# EAGLE design SIHMTEST (EAGLE 8.0.0)
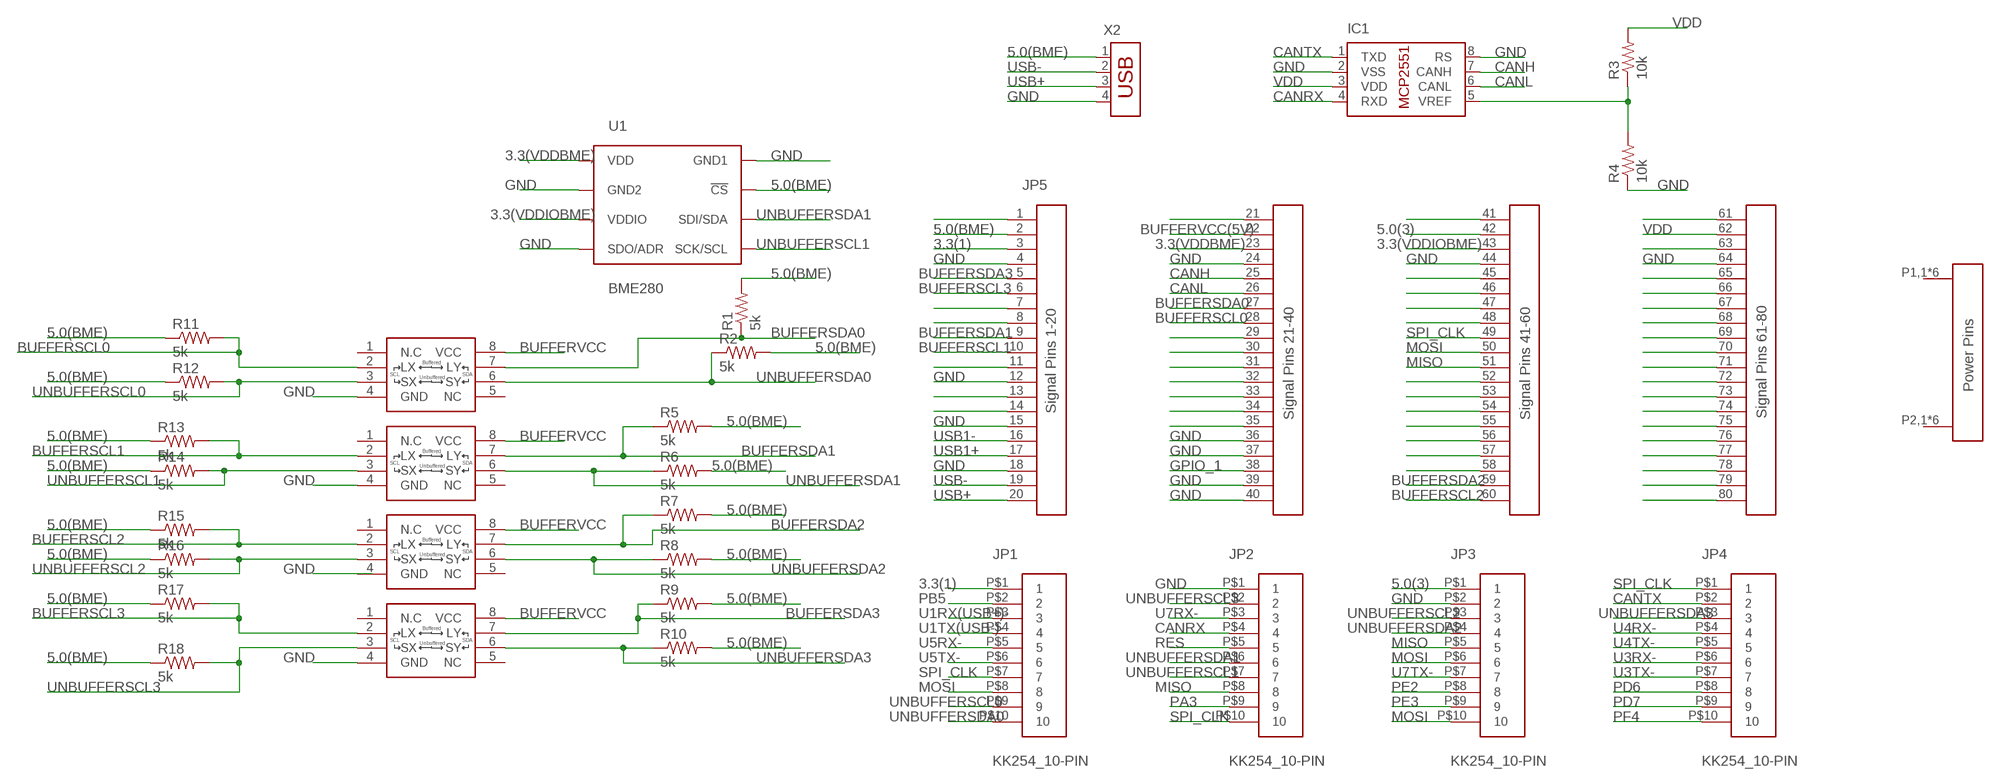
[diagram p0: schematic, sheet 1]

## Parts
IC1  MCP2551/SN  [SO08]
JP1  KK254_10-PIN  [KK254_10-PIN]
JP2  KK254_10-PIN  [KK254_10-PIN]
JP3  KK254_10-PIN  [KK254_10-PIN]
JP4  KK254_10-PIN  [KK254_10-PIN]
JP5  MPSC-01-80MPSC-RA-LC  [MPSC-01-80]
R1  5k  R-US_R0805  [R0805]
R2  5k  R-US_R0805  [R0805]
R3  10k  R-US_R0805  [R0805]
R4  10k  R-US_R0805  [R0805]
R5  5k  R-US_R0805  [R0805]
R6  5k  R-US_R0805  [R0805]
R7  5k  R-US_R0805  [R0805]
R8  5k  R-US_R0805  [R0805]
R9  5k  R-US_R0805  [R0805]
R10  5k  R-US_R0805  [R0805]
R11  5k  R-US_R0805  [R0805]
R12  5k  R-US_R0805  [R0805]
R13  5k  R-US_R0805  [R0805]
R14  5k  R-US_R0805  [R0805]
R15  5k  R-US_R0805  [R0805]
R16  5k  R-US_R0805  [R0805]
R17  5k  R-US_R0805  [R0805]
R18  5k  R-US_R0805  [R0805]
U1  BME280  [BME280_LGA]
U$1  P82B715  [SO8]
U$2  P82B715  [SO8]
U$3  P82B715  [SO8]
U$4  P82B715  [SO8]
X2  USB-787616  [USB]

## Nets
3.3(1): JP1.P$1 JP5.3
3.3(VDDBME): JP5.23 U1.P$8(VDD)
3.3(VDDIOBME): JP5.43 U1.P$6(VDDIO)
5.0(3): JP3.P$1 JP5.42
5.0(BME): JP5.2 R1.2 R2.2 R5.2 R6.2 R7.2 R8.2 R9.2 R10.2 R11.1 R12.1 R13.1 R14.1 R15.1 R16.1 R17.1 R18.1 U1.P$2(!CS) X2.1
BUFFERSCL0: JP5.28 R11.2 U$1.2(LX)
BUFFERSCL1: JP5.10 R13.2 U$2.2(LX)
BUFFERSCL2: JP5.60 R15.2 U$3.2(LX)
BUFFERSCL3: JP5.6 R17.2 U$4.2(LX)
BUFFERSDA0: JP5.27 R1.1 U$1.7(LY)
BUFFERSDA1: JP5.9 R5.1 U$2.7(LY)
BUFFERSDA2: JP5.59 R7.1 U$3.7(LY)
BUFFERSDA3: JP5.5 R9.1 U$4.7(LY)
BUFFERVCC: U$1.8(VCC) U$2.8(VCC) U$3.8(VCC) U$4.8(VCC)
BUFFERVCC(5V): JP5.22
CANH: IC1.7(CANH) JP5.25
CANL: IC1.6(CANL) JP5.26
CANRX: IC1.4(RXD) JP2.P$4
CANTX: IC1.1(TXD) JP4.P$2
GND: IC1.2(VSS) IC1.8(RS) JP2.P$1 JP3.P$2 JP5.4 JP5.12 JP5.15 JP5.18 JP5.24 JP5.36 JP5.37 JP5.39 JP5.40 JP5.44 JP5.64 R4.1 U1.P$1(GND1) U1.P$5(SDO/ADR) U1.P$7(GND2) U$1.4(GND) U$2.4(GND) U$4.4(GND) X2.4
GPIO_1: JP5.38
MISO: JP2.P$8 JP3.P$5 JP5.51
MOSI: JP1.P$8 JP3.P$6 JP3.P$10 JP5.50
N$1: JP5.1
N$2: IC1.5(VREF) R3.1 R4.2
N$7: JP5.7
N$8: JP5.8
N$11: JP5.11
N$13: JP5.13
N$14: JP5.14
N$21: JP5.21
N$29: JP5.29
N$30: JP5.30
N$31: JP5.31
N$32: JP5.32
N$33: JP5.33
N$34: JP5.34
N$35: JP5.35
N$41: JP5.41
N$45: JP5.45
N$46: JP5.46
N$47: JP5.47
N$48: JP5.48
N$52: JP5.52
N$53: JP5.53
N$54: JP5.54
N$55: JP5.55
N$56: JP5.56
N$57: JP5.57
N$58: JP5.58
N$61: JP5.61
N$63: JP5.63
N$65: JP5.65
N$66: JP5.66
N$67: JP5.67
N$68: JP5.68
N$69: JP5.69
N$70: JP5.70
N$71: JP5.71
N$72: JP5.72
N$73: JP5.73
N$74: JP5.74
N$75: JP5.75
N$76: JP5.76
N$77: JP5.77
N$78: JP5.78
N$79: JP5.79
N$80: JP5.80
PA3: JP2.P$9
PB5: JP1.P$2
PD6: JP4.P$8
PD7: JP4.P$9
PE2: JP3.P$8
PE3: JP3.P$9
PF4: JP4.P$10
RES: JP2.P$5
SPI_CLK: JP1.P$7 JP2.P$10 JP4.P$1 JP5.49
U1RX(USB+)-: JP1.P$3
U1TX(USB-)-: JP1.P$4
U3RX-: JP4.P$6
U3TX-: JP4.P$7
U4RX-: JP4.P$4
U4TX-: JP4.P$5
U5RX-: JP1.P$5
U5TX-: JP1.P$6
U7RX-: JP2.P$3
U7TX-: JP3.P$7
UNBUFFERSCL0: JP1.P$9 R12.2 U$1.3(SX)
UNBUFFERSCL1: JP2.P$7 R14.2 U1.P$4(SCK/SCL) U$2.3(SX)
UNBUFFERSCL2: JP3.P$3 R16.2 U$3.3(SX)
UNBUFFERSCL3: JP2.P$2 R18.2 U$4.3(SX)
UNBUFFERSDA0: JP1.P$10 R2.1 U$1.6(SY)
UNBUFFERSDA1: JP2.P$6 R6.1 U1.P$3(SDI/SDA) U$2.6(SY)
UNBUFFERSDA2: JP3.P$4 R8.1 U$3.6(SY)
UNBUFFERSDA3: JP4.P$3 R10.1 U$4.6(SY)
USB1+: JP5.17
USB1-: JP5.16
USB+: JP5.20 X2.3
USB-: JP5.19 X2.2
VDD: IC1.3(VDD) JP5.62 R3.2
Unconnected: JP5.P1,1(POWER1) JP5.P1,2(POWER1) JP5.P1,3(POWER1) JP5.P1,4(POWER1) JP5.P1,5(POWER1) JP5.P1,6(POWER1) JP5.P2,1(POWER2) JP5.P2,2(POWER2) JP5.P2,3(POWER2) JP5.P2,4(POWER2) JP5.P2,5(POWER2) JP5.P2,6(POWER2) U$1.1(N.C) U$1.5(NC) U$2.1(N.C) U$2.5(NC) U$3.1(N.C) U$3.4(GND) U$3.5(NC) U$4.1(N.C) U$4.5(NC)

## Library data of the parts
IC1 = microchip-dspic:MCP2551: High-Speed CAN Transceiver
JP1-JP4 = molex:KK254_10-PIN: KK254 10-pin Datasheet <http://www.molex.com/molex/products/datasheet.jsp?part=active/0022102101_PCB_HEADERS.xml>
JP5 = samtec:MPSC-01-80
R1-R18 = resistor:R-US_: RESISTOR, American symbol
U1 = BME280ComponentLibrary:BME280; PROD_ID: IC-13090
U$1-U$4 = NXP:P82B715
X2 = con-amp:USB-787616: AMP connector

## Board
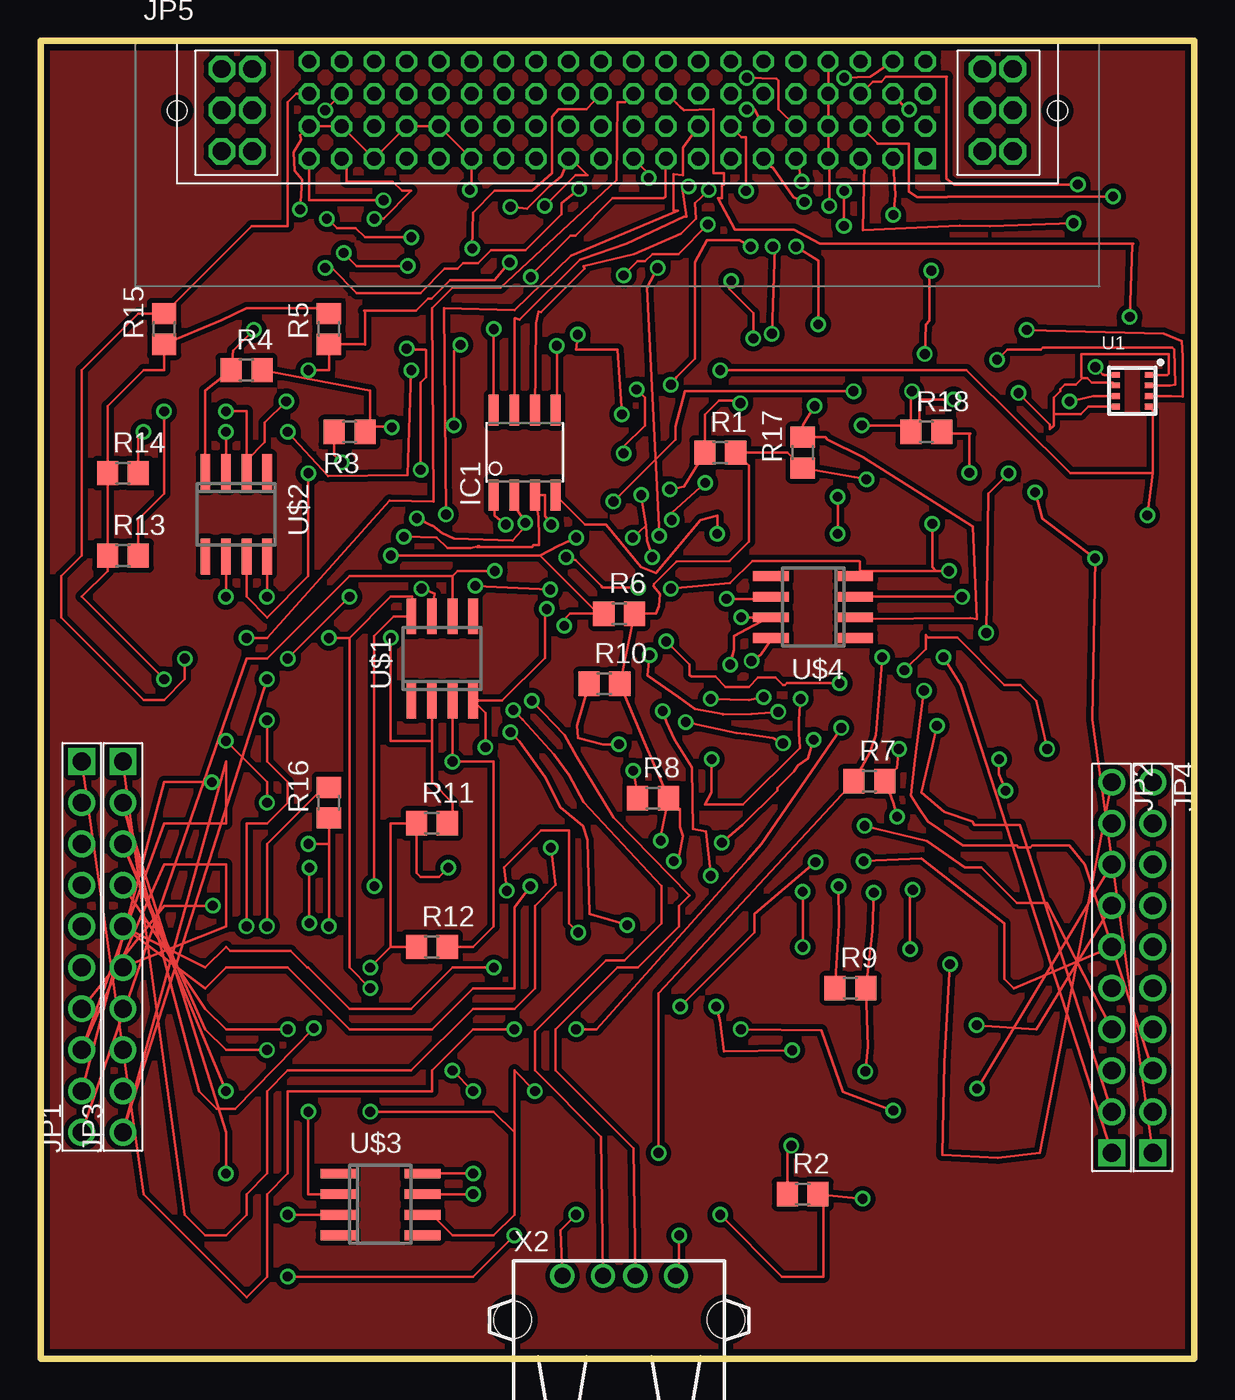
[diagram p1: board, top side]
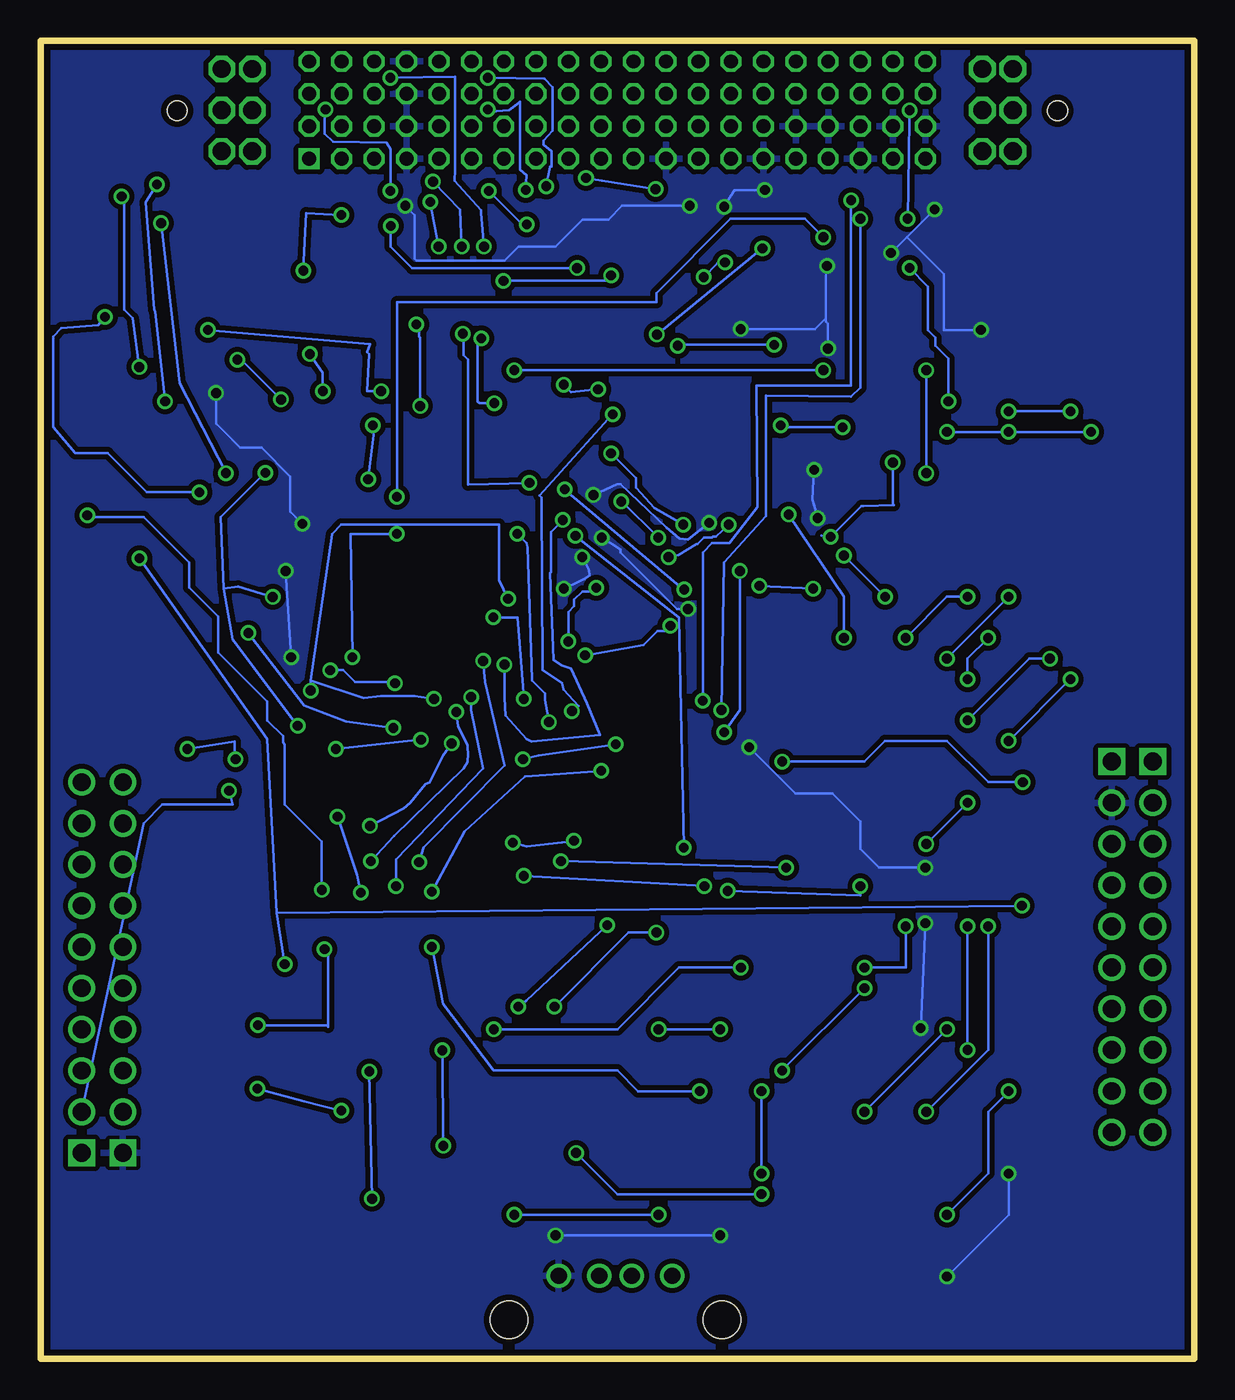
[diagram p2: board, bottom side, seen from below]

Size 71.12 x 81.28 mm. Coordinates in mm from the lower left corner, seen from the top.
Outline: 0,0 0,81.28 71.12,81.28 71.12,0 0,0
Copper layers (1*16): Top 0.0356mm / dielectric 1.5011mm / Bottom 0.0356mm
Design rules "OshPark": minimum track width 6mil, minimum drill 13mil, track to track 6mil, track to pad 6mil, pad to pad 6mil, via to via 6mil, smd to smd 6mil, copper to edge 15mil, drill to drill 6mil, minimum pad ring 7mil, minimum via ring 7mil, stop-mask expansion 3mil, vias tented up to drill 0mil, thermal gap 10mil

### Footprints (pad centres in the part's own frame; a part is rotated, then mirrored left to right if it is on the bottom)
SO08 = smd 0.61 x 1.905: 1 -1.905,-2.616; 2 -0.635,-2.616; 3 0.635,-2.616; 4 1.905,-2.616; 5 1.905,2.616; 6 0.635,2.616; 7 -0.635,2.616; 8 -1.905,2.616
KK254_10-PIN = drill 1.1 square: P$1 11.43,0 | drill 1.1: P$2 8.89,0; P$3 6.35,0; P$4 3.81,0; P$5 1.27,0; P$6 -1.27,0; P$7 -3.81,0; P$8 -6.35,0; P$9 -8.89,0; P$10 -11.43,0
MPSC-01-80 = drill 0.86 square: 1 19,0.33 | drill 0.86 octagon: 2 17,0.33; 3 15,0.33; 4 13,0.33; 5 11,0.33; 6 9,0.33; 7 7,0.33; 8 5,0.33; 9 3,0.33; 10 1,0.33; 11 -1,0.33; 12 -3,0.33; 13 -5,0.33; 14 -7,0.33; 15 -9,0.33; 16 -11,0.33; 17 -13,0.33; 18 -15,0.33; 19 -17,0.33; 20 -19,0.33; 21 19,2.33; 22 17,2.33; 23 15,2.33; 24 13,2.33; 25 11,2.33; 26 9,2.33; 27 7,2.33; 28 5,2.33; 29 3,2.33; 30 1,2.33; 31 -1,2.33; 32 -3,2.33; 33 -5,2.33; 34 -7,2.33; 35 -9,2.33; 36 -11,2.33; 37 -13,2.33; 38 -15,2.33; 39 -17,2.33; 40 -19,2.33; 41 19,4.33; 42 17,4.33; 43 15,4.33; 44 13,4.33; 45 11,4.33; 46 9,4.33; 47 7,4.33; 48 5,4.33; 49 3,4.33; 50 1,4.33; 51 -1,4.33; 52 -3,4.33; 53 -5,4.33; 54 -7,4.33; 55 -9,4.33; 56 -11,4.33; 57 -13,4.33; 58 -15,4.33; 59 -17,4.33; 60 -19,4.33; 61 19,6.33; 62 17,6.33; 63 15,6.33; 64 13,6.33; 65 11,6.33; 66 9,6.33; 67 7,6.33; 68 5,6.33; 69 3,6.33; 70 1,6.33; 71 -1,6.33; 72 -3,6.33; 73 -5,6.33; 74 -7,6.33; 75 -9,6.33; 76 -11,6.33; 77 -13,6.33; 78 -15,6.33; 79 -17,6.33; 80 -19,6.33 | drill 1.1 octagon: P1,1 -24.385,0.79; P1,2 -22.505,0.79; P1,3 -24.385,3.33; P1,4 -22.505,3.33; P1,5 -24.385,5.87; P1,6 -22.505,5.87; P2,1 24.385,0.789; P2,2 22.505,0.789; P2,3 24.385,3.329; P2,4 22.505,3.329; P2,5 24.385,5.869; P2,6 22.505,5.869 | hole 1.2: -27.145,3.3; 27.145,3.3
R0805 = smd 1.3 x 1.5: 1 -0.95,0; 2 0.95,0
BME280_LGA = smd 0.5 x 0.35: P$1 1.025,0.975; P$2 1.025,0.325; P$3 1.025,-0.325; P$4 1.025,-0.975; P$5 -1.025,-0.975; P$6 -1.025,-0.325; P$7 -1.025,0.325; P$8 -1.025,0.975
SO8 = smd 0.6 x 2.2: 1 -1.905,-2.6; 2 -0.635,-2.6; 3 0.635,-2.6; 4 1.905,-2.6; 5 1.905,2.6; 6 0.635,2.6; 7 -0.635,2.6; 8 -1.905,2.6
USB = drill 1: 1 -3.5,12.99; 2 -1,12.99; 3 1,12.99; 4 3.5,12.99 | hole 2.3: -6.57,10.28; 6.57,10.28

### Placement (x,y rotation side)
IC1  29.84,55.88 0 top
JP1  2.54,25.4 90 top
JP2  66.04,24.13 270 top
JP3  5.08,25.4 90 top
JP4  68.58,24.13 270 top
JP5  35.56,73.66 0 top
R1  41.91,55.88 0 top
R2  46.99,10.16 0 top
R3  19.05,57.15 180 top
R4  12.7,60.96 0 top
R5  17.78,63.5 90 top
R6  35.67,45.95 0 top
R7  51.1,35.62 0 top
R8  37.76,34.58 0 top
R9  49.94,22.86 0 top
R10  34.76,41.62 0 top
R11  24.13,33.02 0 top
R12  24.13,25.4 0 top
R13  5.08,49.53 0 top
R14  5.08,54.61 0 top
R15  7.62,63.5 90 top
R16  17.78,34.29 90 top
R17  46.99,55.88 90 top
R18  54.61,57.15 0 top
U1  67.31,59.69 0 top
U$1  24.77,43.18 0 top
U$2  12.06,52.07 180 top
U$3  20.95,9.53 270 top
U$4  47.62,46.35 90 top
X2  35.67,-7.86 0 top

### Tracks (layer width: path | path; a pad name or v marks a point on that pad's centre or on a via)
3.3(1)  (via drill 0.6)
  Top 0.152: JP1.P$1 6.35,10.16 12.7,3.81 13.97,5.08 13.97,10.16 15.24,11.43 15.24,16.51 24.13,16.51 24.13,17.78 26.67,20.32 v29.21,20.32 | v33.02,20.32 34.29,20.32 43.65,30.82 44.45,31.75 v49.37,38.9 | v58.31,44.76 58.42,53.34 v59.69,54.61 | v63.68,70.02 58.53,69.85 56.69,69.86 50.69,69.58 50.8,73.75 JP5.3
  Bottom 0.152: v29.21,20.32 v33.02,20.32 | v49.37,38.9 52.29,39.3 54.86,40.28 v58.31,44.76 | v59.69,54.61 62.54,60.15 v63.68,70.02
3.3(VDDBME)  (via drill 0.6)
  Top 0.152: U1.P$8 65.58,60.66 65.55,60.69 65.49,60.69 v65.04,61.15 | v66.12,71.67 55.95,71.67 55.89,71.61 54.06,71.61 53.55,71.95 53.55,74.92 51.61,74.92 51.61,74.94 JP5.23
  Bottom 0.152: v65.04,61.15 65.44,64.18 65.95,64.69 65.95,71.5 v66.12,71.67
3.3(VDDIOBME)  (via drill 0.6)
  Top 0.152: U1.P$6 64.91,59.37 v63.44,59.04 | v63.95,72.41 56.35,72.41 55.84,72.75 55.84,78.98 55.89,79.04 52.12,79.04 51.84,78.75 51.32,78.75 JP5.43
  Bottom 0.152: v63.44,59.04 64.06,64.58 64.12,64.69 64.64,71.32 v63.95,72.41
5.0(3)  (via drill 0.6)
  Top 0.152: JP3.P$1 8.89,8.89 10.16,7.62 11.43,7.62 12.7,8.89 12.7,10.16 13.97,11.43 13.97,16.51 15.24,17.78 22.86,17.78 26.67,21.59 29.21,21.59 30.48,22.86 30.48,27.94 31.75,29.21 v31.46,31.52 | v38.14,50.74 37.4,66.04 v38.04,67.25 | v49.53,69.85 49.53,71.99 v49.55,72.01 | v53.55,77.04 53.49,76.89 JP5.42
  Bottom 0.152: v31.46,31.52 31.75,45.72 v38.14,50.74 | v38.04,67.25 48.2,67.25 49.53,68.58 v49.53,69.85 | v49.55,72.01 49.55,74.58 49.78,74.98 53.09,75.04 53.61,75.55 53.61,76.81 v53.55,77.04
5.0(BME)  (via drill 0.6)
  Top 0.152: 17.36,64.77 12.7,64.77 11.17,64.04 R15.1 7.62,60.96 6.35,60.96 4.13,58.74 R14.1 R13.1 4.13,48.58 2.54,46.99 v7.62,41.91 | v11.43,38.1 13.97,35.56 v13.97,34.29 | v16.51,31.75 17.78,31.75 R16.1 v17.78,26.67 | X2.1 32.06,7.93 v33.02,8.89 | v41.91,8.89 45.72,5.08 48.26,5.08 48.26,9.84 R2.2 v50.68,9.87 | v20.32,24.13 21.59,25.4 | 21.59,25.4 R12.1 | 21.59,25.4 21.59,33.02 R11.1 23.18,29.97 23.43,29.72 24.57,29.72 v25.15,30.29 | v50.85,17.72 51,19.24 R9.2 51.29,26.38 v51.38,28.75 | R8.2 37.22,38 R10.2 R6.2 37.95,45.95 38.12,46.41 38.18,47.15 37.78,47.66 37.83,47.78 39.2,49.15 42.46,49.21 43.66,50.41 43.66,55.08 R1.2 46.04,55.88 R17.1 50.17,54.36 v50.92,54.23 | R8.2 39.43,33.91 39.43,32.8 39.6,32.23 39.38,30.98 v39.03,30.69 | R8.2 38.25,32.31 v38.23,31.95 | v42.01,31.83 43.26,32.92 45.43,35.03 45.43,35.2 46.46,36.23 46.69,36.58 47.32,37.03 v47.66,38.18 | v52.92,37.6 52.81,36.43 R7.2 52.12,35.55 52.58,34.29 v52.81,33.43 | U1.P$2 69.62,60.02 69.95,60.06 69.89,62.24 69.78,62.35 61.78,62.35 61.66,62.24 59.61,62.24 v58.98,61.61 | v50.63,57.55 53.26,57.55 R18.1 | v56.29,59.15 54.29,59.15 54.18,59.04 54.18,57.67 R18.1 | R18.1 53.66,59.6 v53.72,59.66 | v54.52,61.95 54.58,63.78 54.81,64.01 54.81,66.98 v54.92,67.09 | v52.58,70.52 52.71,71.78 JP5.2
  Top 0.406: 17.78,64.77 R5.2 17.36,64.77
  Bottom 0.152: v7.62,41.91 v11.43,38.1 | v13.97,34.29 v16.51,31.75 | v33.02,8.89 v41.91,8.89 | v17.78,26.67 17.78,24.13 v20.32,24.13 | v50.85,17.72 v50.68,9.87 | v25.15,30.29 v39.03,30.69 | v38.23,31.95 38.98,31.83 41.15,31.6 v42.01,31.83 | v51.38,28.75 51.61,29.83 v52.81,33.43 | v47.66,38.18 v52.92,37.6 | v50.92,54.23 50.52,57.44 v50.63,57.55 | v58.98,61.61 58.75,61.61 v56.29,59.15 | v53.72,59.66 53.72,60.81 v54.52,61.95 | v54.92,67.09 54.75,70.64 v52.58,70.52
5V
  pour Top (isolate 0.305): 0,81.28 0,0 71.12,0 71.12,81.28
BUFFERSCL0  (via drill 0.6)
  Top 0.152: 24.13,38.1 24.13,35.56 25.4,34.29 25.4,33.34 R11.2 | U$1.2 24.13,38.1 | 24.13,38.1 21.59,38.1 v21.59,44.45 | v25,52.06 24.89,64.77 29.21,64.66 32.7,68.03 39.31,70.78 39.03,70.83 39.03,73.04 39.6,72.98 39.6,74.69 JP5.28
  Bottom 0.152: v21.59,44.45 21.59,46.99 v25,52.06
BUFFERSCL1  (via drill 0.6)
  Top 0.152: R13.2 6.03,51.75 7.62,53.34 v7.62,58.42 | v11.43,58.42 12.7,58.42 U$2.2 12.7,55.39 13.83,56.52 13.83,57.72 v15.14,59.04 | v17.55,67.27 17.95,67.27 19.49,65.72 23.43,65.72 24.92,67.21 25.72,67.21 26.06,67.55 26.98,67.55 27.77,68.35 29.89,68.35 32.12,70.58 32.12,71.27 v33.2,72.12 | v37.49,72.81 37.51,73.04 JP5.10
  Bottom 0.152: v7.62,58.42 v11.43,58.42 | v15.14,59.04 15.14,61.66 15.95,62.47 15.95,62.98 16.4,63.44 16.4,66.12 v17.55,67.27 | v33.2,72.12 36.52,72.64 v37.49,72.81
BUFFERSCL2  (via drill 0.6)
  Top 0.152: JP5.60 15.76,77.99 15.24,77.47 15.24,69.85 13.02,69.85 R15.2 6.03,64.45 2.54,60.96 2.54,49.53 1.27,48.26 1.27,45.72 6.35,40.64 7.62,40.64 8.89,41.91 v8.89,43.18 | v13.97,39.37 13.97,36.83 15.24,35.56 15.24,34.29 13.97,33.02 12.7,33.02 v12.7,26.67 | v16.51,15.24 16.51,10.16 U$3.2
  Bottom 0.152: v8.89,43.18 10.16,43.18 v13.97,39.37 | v12.7,26.67 12.7,19.05 v16.51,15.24
BUFFERSCL3  (via drill 0.6)
  Top 0.152: v47.72,58.75 46.99,57.56 R17.2 48.38,56.83 48.52,56.69 50.69,55.61 57.49,51.32 57.72,45.61 57.32,45.66 50.34,45.61 U$4.2 | v47.95,63.78 47.95,67.72 v46.58,68.58 | v47.09,71.32 46.41,71.61 45.15,73.44 45.03,73.52 JP5.6
  Bottom 0.152: v47.72,58.75 47.72,62.98 47.78,63.04 47.78,63.61 v47.95,63.78 | v46.58,68.58 v47.09,71.32
BUFFERSDA0  (via drill 0.6)
  Top 0.152: U$1.7 24.3,47.19 v23.49,47.49 | v26.8,47.66 v31.43,47.43 | v38.8,53.61 39.66,53.78 R1.1 40.96,58.22 41.83,59.09 42.98,59.09 v43.15,58.92 | v43.95,62.92 43.95,64.47 42.46,65.95 42.46,66.35 v42.58,66.47 | v35.95,66.81 36.8,67.67 37.26,67.67 37.72,68.12 39.32,68.12 v41.15,69.95 | v43.49,72.01 43.49,75.32 43.23,75.32 JP5.27
  Bottom 0.152: v23.49,47.49 v26.8,47.66 | v31.43,47.43 31.89,47.78 v38.8,53.61 | v43.15,58.92 44.06,58.92 44.18,59.04 44.18,62.69 v43.95,62.92 | v42.58,66.47 36.29,66.47 v35.95,66.81 | v41.15,69.95 41.43,69.95 v43.49,72.01
BUFFERSDA1  (via drill 0.6)
  Top 0.152: 12.7,49.53 U$2.7 12.7,46.99 13.97,45.72 16.51,48.26 v16.51,54.61 | v16.51,60.96 17.78,60.96 R5.1 19.98,62.55 20,62.52 20,64.58 19.95,64.64 23.15,64.64 23.89,65.38 24.12,65.38 25.26,66.52 28,66.52 v28.92,67.61 | v30.23,66.69 30.46,67.04 32.69,69.27 32.98,69.27 35.26,71.55 38.41,71.55 38.52,71.67 38.52,73.95 JP5.9
  Bottom 0.152: v16.51,54.61 v16.51,60.96 | v28.92,67.61 29.38,67.55 v30.23,66.69
BUFFERSDA2  (via drill 0.6)
  Top 0.152: U$3.7 v26.67,10.16 | v38.1,12.7 38.1,22.54 R7.1 51.12,37.4 51.49,38.46 v51.89,43.26 | v49.15,50.86 v49.15,53.15 | v22.86,69.15 20,69.15 19.43,69.72 18.29,69.72 v17.66,70.29 | v17.55,76.98 JP5.59
  Bottom 0.152: v26.67,10.16 35.56,10.16 v38.1,12.7 | v51.89,43.26 52.01,50.86 v49.15,50.86 | v49.15,53.15 49.15,65.15 33.15,65.15 33.15,65.72 28.57,70.29 24,70.29 v22.86,69.15 | v17.66,70.29 17.55,76.41 v17.55,76.98
BUFFERSDA3  (via drill 0.6)
  Top 0.152: R9.1 49.22,26.79 v49.21,29.15 | v44.58,40.8 43.66,40.63 v41.32,40.69 | v43.2,45.72 44.29,45.72 44.35,45.66 44.81,45.66 | 44.81,45.66 44.97,45.66 U$4.7 44.81,45.66 | 44.81,45.66 42.75,44.58 42.75,43.72 v42.52,42.8 | v38.92,51.72 38.92,52.18 v40.98,54.01 | v45.09,63.21 45.26,68.52 v45.15,68.58 | v46.92,72.58 46.69,73.86 JP5.5
  Bottom 0.152: v49.21,29.15 49.21,30.8 43.83,36.41 44.58,40.01 v44.58,40.8 | v41.32,40.69 41.72,45.72 v43.2,45.72 | v42.52,42.8 42.52,40.75 42.46,39.66 41.15,38.23 40.86,38.06 36.63,38.46 37.43,40.41 38.41,42.58 38.98,42.75 39.49,43.09 39.72,48.46 39.66,48.52 39.66,50.98 v38.92,51.72 | v40.98,54.01 44.75,53.89 44.75,61.61 45.03,61.89 45.03,63.15 v45.09,63.21 | v45.15,68.58 45.26,70.87 v46.92,72.58
BUFFERVCC  (via drill 0.6)
  Top 0.152: U$3.8 v26.67,11.43 | 19.05,44.45 19.05,24.13 v20.32,22.86 | 19.05,44.45 21.59,46.99 22.92,46.99 U$1.8 21.78,45.78 20.57,44.58 v20.57,29.15 | U$2.8 v13.97,46.99 | v17.78,44.45 19.05,44.45 | v25.4,17.78 v26.67,16.51 | v28.75,28.86 28.57,30.29 30.86,32.58 32.58,32.58 32.58,26.86 v33.15,26.29 | v39.43,21.72 44.01,26.29 44.01,27.43 v47.78,30.63 | v43.83,43.03 44.41,43.43 45.03,44.33 U$4.8
  Bottom 0.152: v26.67,11.43 v26.67,16.51 | v13.97,46.99 15.24,46.99 v17.78,44.45 | v20.32,22.86 v25.4,17.78 | v20.57,29.15 20.57,28.57 v28.75,28.86 | v33.15,26.29 34.86,26.29 v39.43,21.72 | v47.78,30.63 47.49,31.55 42.52,36.58 43.72,41.72 v43.83,43.03
CANH  (via drill 0.6)
  Top 0.152: IC1.7 29.21,64.13 29.26,64.18 29.55,64.06 33.26,67.78 33.43,67.84 36.12,68.75 39.66,70.41 39.83,70.41 39.55,72.3 v39.95,72.3 | v43.55,78.98 45.38,78.92 45.49,78.81 45.49,77.06 JP5.25
  Bottom 0.152: v39.95,72.3 39.72,73.5 39.6,73.5 39.6,74.47 40.12,74.87 40.12,75.09 39.55,75.72 39.55,78.41 40.06,78.92 v43.55,78.98
CANL  (via drill 0.6)
  Top 0.152: IC1.6 30.54,63.86 30.69,64.58 30.86,64.52 33.55,67.21 33.49,67.38 36.58,68.12 39.49,69.38 40.41,70.29 40.35,71.27 v41.2,72.07 | v43.55,77.04 44.03,77.04 JP5.26
  Bottom 0.152: v41.2,72.07 41.15,72.98 41.55,73.32 41.55,77.5 41.6,77.44 42.23,76.98 43.03,76.92 v43.55,77.04
CANRX  (via drill 0.6)
  Top 0.152: v39.78,39.26 42.92,38.58 43.49,38.52 45.15,38.29 v45.78,37.95 | v41.72,50.86 41.72,52.01 40.69,51.72 37.95,48.46 37.03,48.81 34.86,51.44 33.58,51.44 IC1.4 | v50.81,32.86 54.63,31.95 56.98,30.29 58.01,30.29 60.18,28.12 62.05,28.12 JP2.P$4
  Bottom 0.152: v39.78,39.26 40.01,40.63 40.01,41.03 40.8,41.83 40.8,41.89 41.09,50.06 41.15,50.29 v41.72,50.86 | v45.78,37.95 46.29,37.2 47.15,35.55 47.38,35.43 48.35,34.29 48.75,33.95 v50.81,32.86
CANTX  (via drill 0.6)
  Top 0.152: v62.06,37.6 61.38,40.58 60.41,41.55 59.44,41.55 56.52,44.46 54.75,44.46 54.58,44.63 54.58,43.78 v53.26,42.46 | v49.26,41.66 46.01,41.66 45.89,41.55 45.78,41.55 45.32,42.01 44.23,42.01 43.66,41.43 42.23,41.43 41.6,42.06 40.12,42.06 40.01,42.18 40.01,42.8 v38.58,44.23 | v36.86,47.55 34.63,47.55 34.58,47.61 34.58,47.66 32.98,49.26 32.69,49.32 v32.4,49.44 | v28.69,51.44 28.52,51.55 28,52.01 28,53.2 IC1.1 | v59.49,35.03 59.44,34.98 59.38,35.32 59.09,36.06 v59.09,36.98
  Bottom 0.152: JP4.P$2 64.76,33.02 63.61,34.18 59.27,34.18 v59.49,35.03 | v62.06,37.6 59.15,38.06 59.15,37.6 v59.09,36.98 | v53.26,42.46 52.46,42.46 51.72,41.72 49.32,41.72 v49.26,41.66 | v38.58,44.23 38.58,46.06 38.23,46.41 38.23,46.81 37.72,47.32 37.09,47.32 v36.86,47.55 | v32.4,49.44 31.77,49.55 30.69,50.23 30.63,50.23 30.23,50.63 29.72,50.63 29.66,50.69 29.49,50.69 v28.69,51.44
GND  (via drill 0.6)
  Top 0.152: v11.43,11.43 11.43,13.97 JP3.P$2 9.78,16.51 10.86,15.43 12,15.43 v16.86,20.4 | v15.24,5.08 26.67,5.08 v29.21,7.62 | v39.37,7.62 39.37,4.41 X2.4 | U$2.4 10.16,59.69 R4.1 11.86,62.16 v13.14,63.44 | v16.57,26.86 v16.57,30.29 | v27.43,37.72 27.43,39.82 U$1.4 28.46,40.58 31.09,43.2 31.09,46.06 31.2,46.18 v31.2,46.23 | v16,70.87 16.12,72.69 15.66,73.27 15.6,74.41 16.06,75.15 16,75.43 JP5.40 JP5.39 JP5.18 JP5.37 JP5.36 JP5.15 26.56,72.17 v26.46,72.07 | JP2.P$1 56.74,41.56 v55.66,43.26 | v56.01,48.58 55.21,48.58 | 55.21,48.58 50.54,48.58 U$4.4 50.52,48.56 50.52,49.15 50.46,49.21 43.89,49.21 42.52,47.84 v38.86,47.49 | IC1.2 29.21,52.57 v29.89,51.55 29.95,51.38 29.09,50.46 25.49,50.58 24.75,50.92 24.17,51.38 24.12,51.38 v23.2,51.84 | v23.43,54.81 23.43,60.18 23.77,60.52 23.77,62.18 23.72,62.24 22.63,62.24 v22.57,62.29 | v22.63,67.38 19.49,67.38 v18.69,68.18 | v37.03,53.26 37.32,51.38 | 37.32,51.38 37.38,50.46 v37.72,49.44 | v36.52,50.63 37.32,51.38 | JP5.64 JP5.44 JP5.24 JP5.4 48.63,73.92 v48.63,71.09 | U1.P$1 69.47,60.66 69.55,60.75 69.55,61.95 64.18,61.95 64.18,60.52 64.24,60.47 | 64.24,60.47 64.52,60.47 64.81,60.18 66.12,60.18 U1.P$7 | U1.P$5 64.6,58.72 64.12,58.24 62.47,58.24 | 62.47,58.24 62.47,59.27 62.87,59.66 62.87,59.78 63.15,60.06 63.84,60.06 64.24,60.47 | 62.47,58.24 62.47,57.55 62.24,57.32 62.24,57.61 v60.29,59.55 | v54.98,51.49 54.98,48.81 55.21,48.58 | IC1.8 v27.94,63.49 v27.95,63.49 | v28.98,71.04 30,70.92 31.38,72.3 32.12,72.92 JP5.12 32.71,73.99 33.72,72.98 32.98,72.98 v31.09,71.09
  Bottom 0.152: v11.43,11.43 11.43,8.89 v15.24,5.08 | v29.21,7.62 v39.37,7.62 | v16.86,20.4 v16.57,26.86 | v16.57,30.29 19.43,30.29 20.57,31.43 20.57,33.15 22.29,34.86 24.57,34.86 v27.43,37.72 | v13.14,63.44 15.43,63.44 15.43,66.86 17.72,69.15 | 17.72,69.15 v16,70.87 | v55.66,43.26 v56.01,48.58 | v23.2,51.84 23.26,52.06 23.55,52.98 v23.43,54.81 | v22.57,62.29 22.57,63.84 22.69,63.95 22.69,64.18 | 22.69,64.18 22.69,67.32 v22.63,67.38 | v18.69,68.18 17.72,69.15 | v31.2,46.23 31.89,46.23 35.38,49.72 35.38,49.89 v36.52,50.63 | v29.89,51.55 31.2,50.52 31.72,50.58 32.52,51.26 35.38,53.95 35.55,53.95 v37.03,53.26 | v37.72,49.44 37.32,48.63 37.26,48.29 37.55,48.12 38.23,47.78 v38.86,47.49 | v60.29,59.55 60.29,57.66 58.81,56.18 57.49,56.18 55.72,54.41 55.72,52.23 v54.98,51.49 | v27.95,63.49 23.37,63.49 22.69,64.18 | v26.46,72.07 28.35,72.07 v28.98,71.04 | v31.09,71.09 35.26,71.09 36.12,70.24 37.72,70.24 39.38,68.58 41.66,68.58 42.52,67.72 47.95,67.72 48.06,67.84 48.06,70.52 v48.63,71.09
  pour Bottom (isolate 0.305): 0,0 0,81.28 71.12,81.28 71.12,0
MISO  (via drill 0.6)
  Top 0.152: v27.94,24.13 25.4,24.13 22.86,21.59 19.05,21.59 16.51,24.13 16.45,24.13 15.43,25.15 11.68,25.15 11.43,25.4 10.16,24.13 JP3.P$5 10.16,22.86 11.43,24.13 15.24,24.13 19.05,20.32 24.13,20.32 26.67,22.86 29.21,22.86 29.21,27.83 v30.19,29.15 | v43.18,20.32 48.16,20.26 49.45,16.45 v52.58,15.31 | v57.75,16.66 JP2.P$8 | v35.85,58.24 35.56,62.23 33.02,62.23 v33.12,63.16 | v26.61,68.47 26.67,70.67 28,72.01 30.29,72.01 31.55,73.09 31.55,76.58 31.95,77.04 33.66,77.04 JP5.51 | v41.33,29.78 41.04,32.51 40.23,32.69 40.18,36.46 39.09,38.18 38.58,39.26 v38.35,39.94
  Bottom 0.152: v27.94,24.13 31.75,24.13 35.56,20.32 v43.18,20.32 | v52.58,15.31 54.86,15.89 v57.75,16.66 | v30.19,29.15 v41.33,29.78 | v35.85,58.24 40.35,53.21 40.23,53.09 40.18,42.46 38.98,41.66 38.86,41.26 37.95,40.24 v38.35,39.94 | v33.12,63.16 v26.61,68.47
MOSI  (via drill 0.6)
  Top 0.152: JP3.P$6 11.43,26.67 11.43,30.48 7.62,30.48 JP1.P$8 7.62,33.02 11.43,33.02 11.43,36.83 JP3.P$10 v13.97,41.91 | v12.7,44.45 13.97,44.45 21.53,52.93 24.24,52.87 24.13,64.77 25.4,66.04 28.35,66.04 35.5,72.68 35.56,77.47 36.04,77.47 JP5.50
  Bottom 0.152: v13.97,41.91 13.97,43.18 v12.7,44.45
N$2  (via drill 0.6)
  Top 0.152: R4.2 20.32,59.69 20.32,57.47 | 20.32,57.47 R3.1 | 20.32,57.47 21.63,57.47 v21.66,57.44 | v25.49,57.55 25.49,62.12 v25.89,62.52 | v31.83,62.47 31.83,58.58 IC1.5
  Bottom 0.152: v21.66,57.44 25.38,57.44 v25.49,57.55 | v25.89,62.52 31.77,62.52 v31.83,62.47
SPI_CLK  (via drill 0.6)
  Top 0.152: JP1.P$7 7.62,27.94 v10.62,27.94 | JP4.P$1 64.86,39.41 v65.02,49.36 61.76,51.82 v61.32,53.44 | JP2.P$10 61.59,12.7 59.04,12.4 55.61,12.57 55.72,18.29 v56.06,24.35 | v67.15,64.24 67.32,68.69 67.38,68.75 48.06,68.75 46.46,69.61 42.8,69.61 41.78,71.55 42.01,71.55 42.01,72.41 42.12,72.41 42.12,73.09 41.49,73.09 41.49,77.04 39.66,76.98 39.43,77.21 39.2,77.4 JP5.49
  Bottom 0.152: v10.62,27.94 56.58,27.48 | 56.58,27.48 57.15,38.23 v65.02,49.36 | v56.06,24.35 56.58,27.48 | v61.32,53.44 64.58,53.44 66.98,55.84 68.98,55.84 70.35,57.44 70.35,63.04 69.84,63.55 67.55,63.72 v67.15,64.24
UNBUFFERSCL0  (via drill 0.6)
  Top 0.152: JP1.P$9 7.62,35.56 v10.56,35.56 | U$1.3 v25.4,36.83 27.94,36.83 27.94,26.67 26.67,25.4 R12.2
  Bottom 0.152: v10.56,35.56 12.7,35.56 15.24,38.1 19.05,38.1 20.32,36.83 v25.4,36.83
UNBUFFERSCL1  (via drill 0.6)
  Top 0.152: R14.2 6.03,56.83 v6.35,57.15 | v11.43,57.15 U$2.3 | v22.86,60.96 22.63,54.5 17.72,54.44 v15.24,57.15 | v41.91,60.96 57.09,60.96 63.5,54.61 68.58,54.61 | 68.58,54.61 68.58,58.47 U1.P$4 | JP2.P$7 61.4,20.32 v57.72,20.57 | v68.24,52.01 68.58,54.61 | v53.61,25.26 53.61,28.75 v53.78,28.92
  Bottom 0.152: v6.35,57.15 v11.43,57.15 v15.24,57.15 | v22.86,60.96 v41.91,60.96 | v57.72,20.57 53.49,20.57 53.38,20.46 53.38,25.03 v53.61,25.26 | v53.78,28.92 53.78,31.89 56.06,34.18 56.06,37.89 56.18,38.01 56.18,38.41 57.15,39.38 57.15,40.52 60.18,43.55 60.18,45.78 61.95,47.55 61.95,49.09 64.75,51.89 68.12,51.89 v68.24,52.01
UNBUFFERSCL2  (via drill 0.6)
  Top 0.152: v11.43,16.51 JP3.P$3 10.16,20.32 11.43,19.05 v13.97,19.05 | v15.24,8.89 U$3.3 | R16.2 17.46,35.24 13.97,31.75 v13.97,26.67
  Bottom 0.152: v11.43,16.51 12.7,15.24 12.7,11.43 v15.24,8.89 | v13.97,26.67 v13.97,19.05
UNBUFFERSCL3  (via drill 0.6)
  Top 0.152: JP2.P$2 60.36,32.91 57.56,32.91 57.44,33.15 55.72,33.72 54.29,34.92 54.98,37.78 v55.26,39.03 | v57.26,54.63 57.26,56.98 57.32,57.04 55.67,57.04 R18.2 | U$4.3 56.65,46.99 v56.81,46.98
  Bottom 0.152: v55.26,39.03 59.27,44.35 59.84,47.49 | 59.84,47.49 60.01,51.89 v57.26,54.63 | v56.81,46.98 58.92,47.61 59.84,47.49
UNBUFFERSDA0  (via drill 0.6)
  Top 0.152: JP1.P$10 12.7,43.18 13.97,43.18 19.05,48.26 25.4,48.26 | 25.4,48.26 U$1.6 | R2.1 46.04,12.89 v46.29,13.14 | v46.35,19.03 42.12,18.97 41.89,20.86 v41.66,21.72 | v36.18,26.75 33.83,27.43 33.72,32 33.43,32.86 32.06,34 31.09,35.89 29.55,38.06 v28.98,38.63 | v28,48.58 25.72,48.58 25.4,48.26
  Bottom 0.152: v46.29,13.14 v46.35,19.03 | v41.66,21.72 41.15,22.12 v36.18,26.75 | v28.98,38.63 28,40.01 v28,48.58
UNBUFFERSDA1  (via drill 0.6)
  Top 0.152: U$2.6 v11.43,46.99 | v15.24,43.18 v19.05,46.99 | v21.59,49.53 30.8,49.53 | 30.8,49.53 34.38,45.95 | JP2.P$6 60.01,22.86 59.44,23.43 59.44,26.86 54.29,30.86 v50.75,30.69 | v37.55,43.38 37.43,42.12 39.32,40.8 40.35,40.06 42.06,39.78 42.06,39.72 43.83,39.78 v45.49,39.89 | v32.29,45.21 32.29,45.61 32.63,45.95 34.38,45.95 | 34.38,45.95 R6.1 | U1.P$3 69.71,59.37 70.41,59.32 70.41,61.78 70.35,62.75 69.27,63.21 v60.81,63.44 | v50.12,59.66 39.72,59.66 39.15,57.49 39.15,56.69 v35.32,52.86 | v33.03,50.63 31.91,50.12 30.8,49.53
  Bottom 0.152: v11.43,46.99 v15.24,43.18 | v19.05,46.99 v21.59,49.53 | v50.75,30.69 49.32,32.23 45.03,36.41 44.81,36.8 44.75,37.32 44.81,37.66 44.81,37.83 45.38,39.03 v45.49,39.89 | v37.55,43.38 33.95,44.01 33.09,44.86 32.63,44.86 v32.29,45.21 | v60.81,63.44 50.81,62.58 50.98,62.06 50.86,61.95 50.98,59.66 v50.12,59.66 | v35.32,52.86 35.26,52.86 v33.03,50.63
UNBUFFERSDA2  (via drill 0.6)
  Top 0.152: U$3.6 24.13,8.89 25.4,7.62 27.94,7.62 29.21,8.89 29.21,13.97 | 29.21,13.97 29.21,17.78 v30.48,16.51 | JP3.P$4 10.16,21.59 11.43,20.32 v15.24,20.32 | v20.32,15.24 27.94,15.24 29.21,13.97 | v46.99,25.4 v46.99,28.81 | v36.54,36.26 36.83,34.61 R8.1
  Bottom 0.152: v15.24,20.32 v20.32,15.24 | v30.48,16.51 34.29,16.51 35.56,17.78 43.18,17.78 46.3,21.88 v46.99,25.4 | v46.99,28.81 44.99,32.51 41.24,35.92 v36.54,36.26
UNBUFFERSDA3  (via drill 0.6)
  Top 0.152: JP4.P$3 64.39,30.48 63.44,31.66 61.15,31.66 61.04,31.55 60.29,31.55 60.18,31.66 56.86,31.66 55.38,32.69 54.69,33.15 54.12,34 53.66,34.75 53.89,36.92 v54.46,41.2 | v42.29,46.86 44.9,46.86 U$4.6 | R10.1 33.07,39.06 33.15,38.29 34.69,37.89 v35.66,37.89 | v41.38,36.98 41.38,34.92 40.98,34.18 43.32,34.18 46.81,37.66 46.75,38.58 46.75,39.38 46.81,40.35 v46.86,40.69
  Bottom 0.152: v54.46,41.2 54.46,41.83 | 54.46,41.83 53.15,50.86 52.58,51.44 42.86,51.44 42.86,48.01 v42.29,46.86 | v35.66,37.89 40.41,37.2 v41.38,36.98 | v46.86,40.69 48.06,40.86 50.12,40.86 51.21,40.75 54.46,41.83
USB+  (via drill 0.6)
  Top 0.152: X2.3 36.56,12.97 31.75,17.78 31.75,20.32 35.56,24.13 36.83,24.13 39.37,26.67 39.37,27.94 40.01,28.57 35.32,33.38 33.03,37.15 32.29,38.46 v30.29,40.58 | v21.14,71.44 16.57,71.44 16.57,73.98 JP5.20
  Bottom 0.152: v30.29,40.58 30.29,49.72 29.72,50.29 28.63,50.29 26.92,52.52 26.98,60.01 21.14,60.01 v21.14,71.44
USB-  (via drill 0.6)
  Top 0.152: X2.2 34.56,13.7 30.48,17.78 30.48,20.19 34.86,24.57 36.01,24.57 38.29,26.86 38.29,29.15 33.49,34.35 32.58,36.01 31.66,37.26 29.72,39.43 v29.15,40.01 | v20.57,70.29 21.14,70.29 22.86,72.01 22.29,72.01 21.72,72.58 18.86,72.58 18.86,73.69 JP5.19
  Bottom 0.152: v29.15,40.01 28.98,49.09 26.4,51.95 26.4,59.38 21.14,59.32 20.57,59.89 v20.57,70.29
VDD  (via drill 0.6)
  Top 0.152: R3.2 18.1,55.74 v18.57,55.26 | v22.4,50.69 24.4,50.63 25.09,50.01 26.52,50.01 27.03,50.12 26.98,50.12 26.92,50.06 30.29,50.06 30.4,50.18 30.75,50.18 30.75,50.63 30.69,51.91 IC1.3 31.09,53.26 31.09,51.95 v31.49,51.44 | v35.95,55.84 35.95,56.24 37.26,57.55 37.26,59.27 v36.75,59.78 | v38.86,60.06 39.2,60.52 40.35,61.66 40.35,67.61 41.09,68.98 43.09,68.98 v43.78,68.58 | v49.55,78.98 51.15,79.04 JP5.62
  Bottom 0.152: v18.57,55.26 18.57,52.69 18.52,52.63 20.4,52.58 20.52,52.58 v22.4,50.69 22.97,50.75 | v31.49,51.44 33.26,52.46 34.4,53.72 34.4,54.29 v35.95,55.84 | v36.75,59.78 38.41,59.61 v38.86,60.06 | v43.78,68.58 43.95,70.64 43.95,70.81 45.61,72.64 45.55,73.32 45.55,79.04 v49.55,78.98